# EAGLE design pm25 (EAGLE 9.4.2)
AUTHOR: Jared Wolff; BOARD_NUMBER: BRD-0010; COMPANY: Circuit Dojo; DOC_NUMBER: SCH-0010; DOC_REV: 1; TITLE: Particle^2 Sensor
Assembly variants: Production
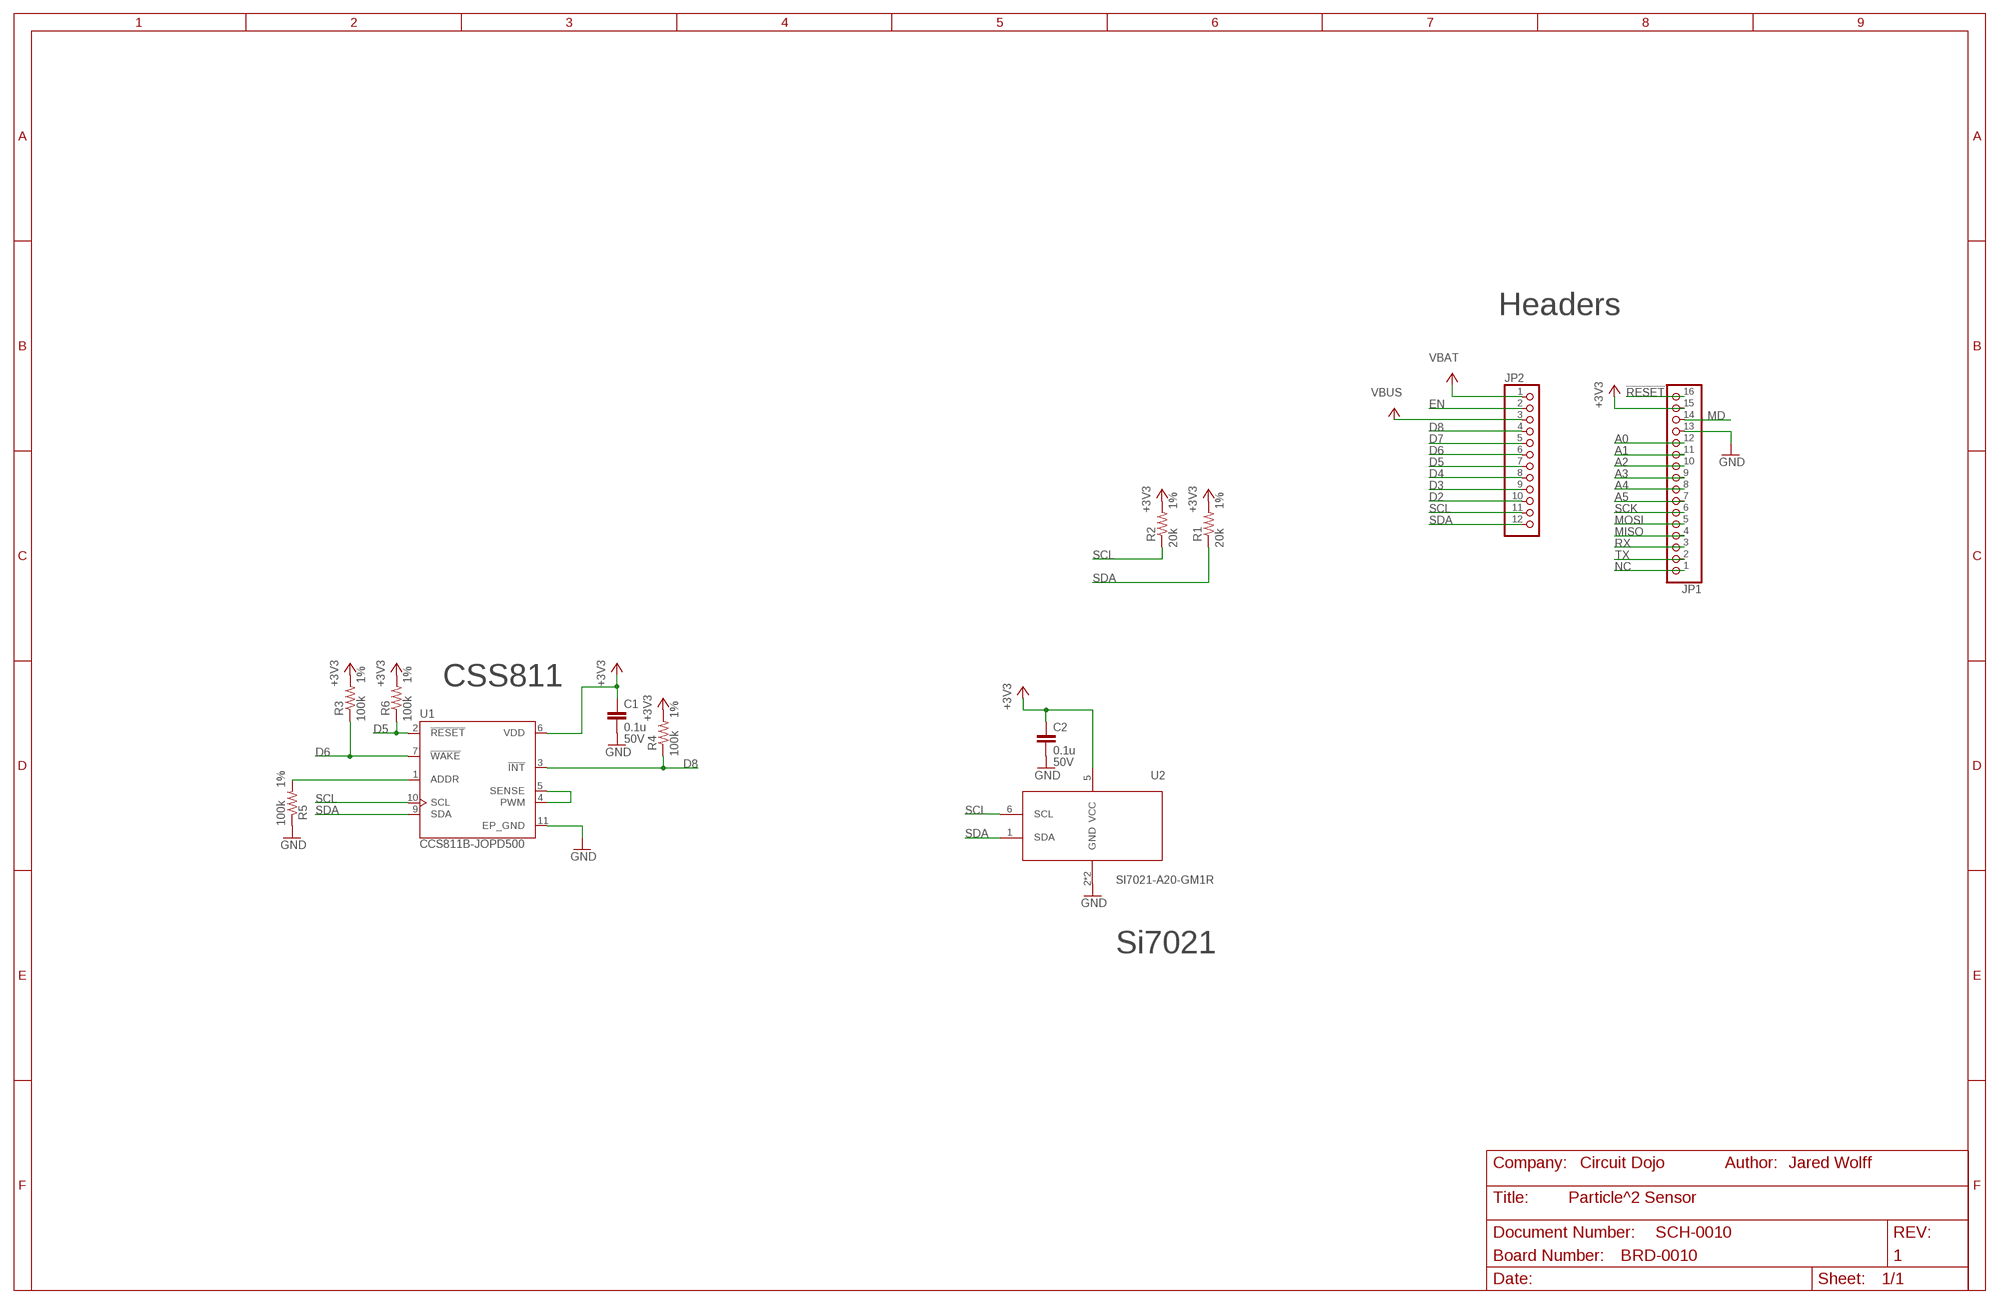
[diagram p0: schematic, sheet 1]

## Parts
C1  0.1u  CAP-0017  [CAPC1005X55N]
C2  0.1u  CAP-0017  [CAPC1005X55N]
JP1  HEADER-1X16ROUND  [1X16_ROUND]
JP2  HEADER-1X12  [1X12_ROUND]
R1  20k  RES-0054  [R0402]
R2  20k  RES-0054  [R0402]
R3  100k  RES-0041  [R0402]
R4  100k  RES-0041  [R0402]
R5  100k  RES-0041  [R0402]
R6  100k  RES-0041  [R0402]
U1  CCS811B-JOPD500  [SON60P400X270X110-11N]
U2  SI7021-A20-GM1R  [SON100P300X300X80-7N]

## Nets
!RESET: JP1.16
+3V3: C1.1 C2.1 JP1.15 R1.2 R2.2 R3.2 R4.2 R6.2 U1.6(VDD) U2.5(VCC)
A0: JP1.12
A1: JP1.11
A2: JP1.10
A3: JP1.9
A4: JP1.8
A5: JP1.7
D2: JP2.10
D3: JP2.9
D4: JP2.8
D5: JP2.7 R6.1 U1.2(!RESET)
D6: JP2.6 R3.1 U1.7(!WAKE)
D7: JP2.5
D8: JP2.4 R4.1 U1.3(!INT)
EN: JP2.2
GND: C1.2 C2.2 JP1.13 R5.1 U1.11(EP_GND) U2.2(GND) U2.7(GND)
MD: JP1.14
MISO: JP1.4
MOSI: JP1.5
N$4: R5.2 U1.1(ADDR)
N$5: U1.4(PWM) U1.5(SENSE)
NC: JP1.1
RX: JP1.3
SCK: JP1.6
SCL: JP2.11 R2.1 U1.10(SCL) U2.6(SCL)
SDA: JP2.12 R1.1 U1.9(SDA) U2.1(SDA)
TX: JP1.2
VBAT: JP2.1
VBUS: JP2.3

## Notes on the sheet
- Headers
- CSS811
- Si7021

## Library data of the parts
C1 C2 = wolff-den:CAP-0017: CAP CER 0.1UF 35V X5R 0402; DESC: CAP CER 0.1UF 50V X5R 0402; DIGIKEYPN: 587-3499-1-ND; MF: Taiyo Yuden; MPN: UMK105BJ104KV-F; VOLTHIGH: 50V
JP1 = microbuilder:HEADER-1X16: PIN HEADER; MPN: PPPC161LFBN-RC
JP2 = microbuilder:HEADER-1X12; MPN: PPPC121LFBN-RC
R1 R2 = wolff-den:RES-0054: RES SMD 20K OHM 1% 1/16W 0402; DIGIKEYPN: 311-20.0KLRCT-ND; MPN: RC0402FR-0720KL; TOLERANCE: 1%; VENDOR: Yageo
R3-R6 = wolff-den:RES-0041: RES SMD 100K OHM 1% 1/16W 0402; DIGIKEYPN: 311-100KLRCT-ND; MPN: RC0402FR07100KL; TOLERANCE: 1%; VENDOR: Yageo
U1 = wolff-den:CCS811B-JOPD500: Low Power Digital Sensor For Ind; DESC: Low Power Digital Sensor For Ind; DIGIKEYPN: CCS811B-JOPD500CT-ND; MF: ams; MPN: CCS811B-JOPD500
U2 = wolff-den:SI7021-A20-GM1R; DESC: SENS HUMID/TEMP 3.6V I2C 2% 6DFN; DIGIKEYPN: 336-4380-1-ND; MPN: SI7021-A20-GM1R

## Board
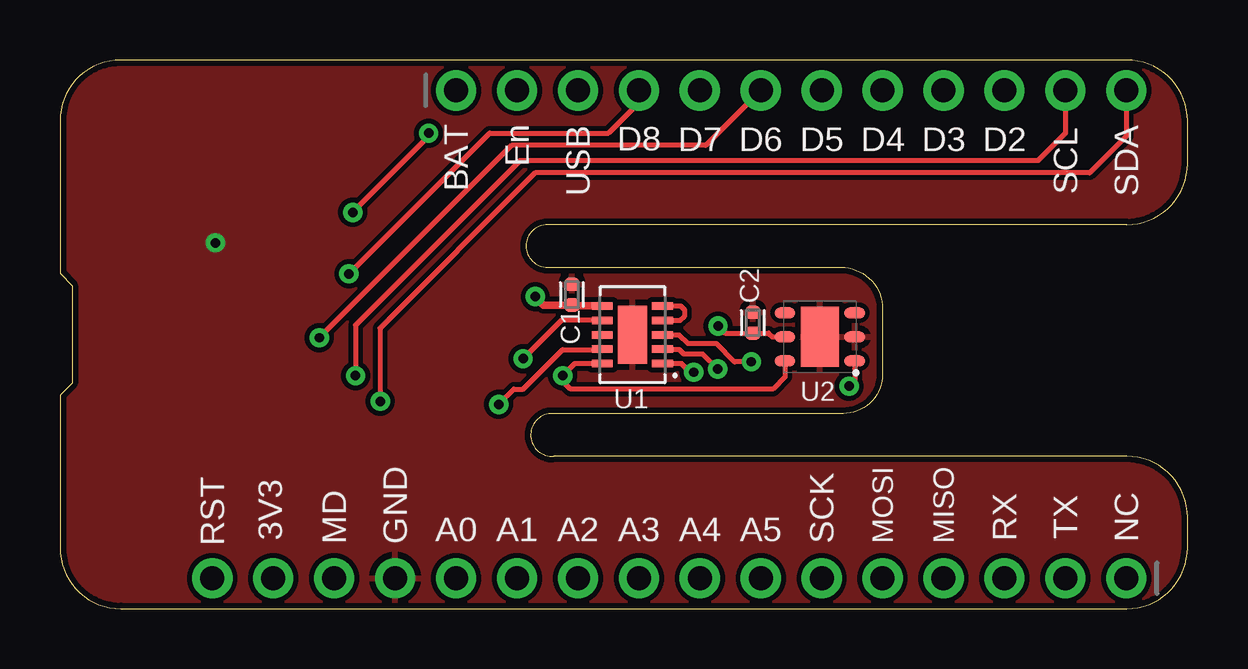
[diagram p1: board, top side]
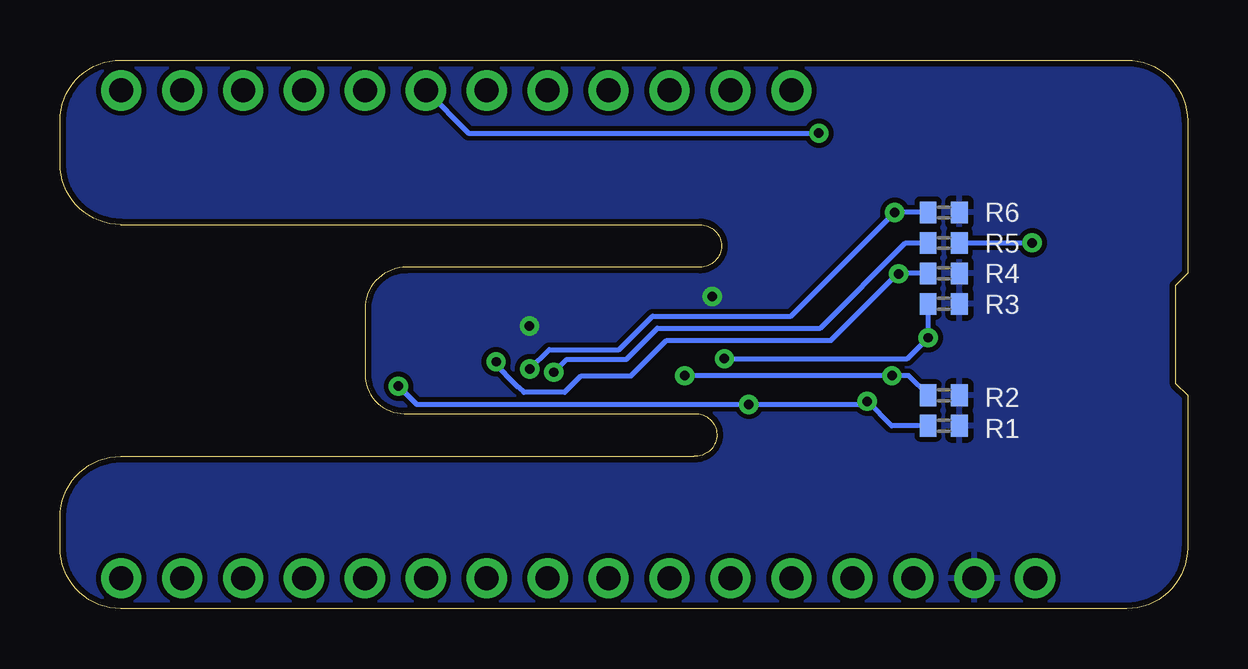
[diagram p2: board, bottom side, seen from below]

Size 47 x 22.86 mm. Coordinates in mm from the lower left corner, seen from the top.
Outline: 47,20.32 47,18.54 arc-90 44.46,16 20.32,16 arc180 20.32,14.22 32.56,14.22 arc-90 34.29,12.49 34.29,9.77 arc-90 32.65,8.13 20.45,8.13 arc180 20.57,6.35 44.46,6.35 arc-90 47,3.81 47,2.54 arc-90 44.46,0 2.54,0 arc-90 0,2.54 0,8.89 0.51,9.4 0.51,13.46 0,13.97 0,20.32 arc-90 2.54,22.86 44.46,22.86
Outline: 47,20.32 arc90 44.46,22.86
Outline: 47,20.32 arc90 44.46,22.86
Outline: 47,20.32 arc90 44.46,22.86
Copper layers (1*16): Top 0.035mm / dielectric 1.5mm / Bottom 0.035mm
Design rules "adafruit *": minimum track width 8mil, minimum drill 15.5mil, track to track 8mil, track to pad 8mil, pad to pad 8mil, via to via 8mil, smd to smd 8mil, copper to edge 10mil, drill to drill 8mil, minimum pad ring 10mil, minimum via ring 8mil, stop-mask expansion 2mil, vias tented up to drill 20mil, thermal gap 10mil

### Footprints (pad centres in the part's own frame; a part is rotated, then mirrored left to right if it is on the bottom)
CAPC1005X55N = smd 0.54 x 0.6: 1 -0.43,0; 2 0.43,0
1X16_ROUND = drill 1 pad 1.676: 1 -19.05,0; 2 -16.51,0; 3 -13.97,0; 4 -11.43,0; 5 -8.89,0; 6 -6.35,0; 7 -3.81,0; 8 -1.27,0; 9 1.27,0; 10 3.81,0; 11 6.35,0; 12 8.89,0; 13 11.43,0; 14 13.97,0; 15 16.51,0; 16 19.05,0
1X12_ROUND = drill 1 pad 1.676: 1 -13.97,0; 2 -11.43,0; 3 -8.89,0; 4 -6.35,0; 5 -3.81,0; 6 -1.27,0; 7 1.27,0; 8 3.81,0; 9 6.35,0; 10 8.89,0; 11 11.43,0; 12 13.97,0
R0402 = smd 0.7 x 0.9: 1 -0.65,0; 2 0.65,0
SON60P400X270X110-11N = smd 0.91 x 0.32: 1 -1.255,1.2; 2 -1.255,0.6; 3 -1.255,0; 4 -1.255,-0.6; 5 -1.255,-1.2; 6 1.255,-1.2; 7 1.255,-0.6; 8 1.255,0; 9 1.255,0.6; 10 1.255,1.2 | smd 1.2 x 2.4: 11 0,0
SON100P300X300X80-7N = smd 0.85 x 0.45: 1 -1.45,1; 2 -1.45,0; 3 -1.45,-1; 4 1.45,-1; 5 1.45,0; 6 1.45,1 | smd 1.6 x 2.5: 7 0,0

### Placement (x,y rotation side)
C1  21.34,13.08 90 top
C2  28.88,11.91 90 top
JP1  25.4,1.27 180 top
JP2  30.48,21.59 0 top
R1  10.16,7.62 0 bottom
R2  10.16,8.89 0 bottom
R3  10.16,12.7 0 bottom
R4  10.16,13.97 0 bottom
R5  10.16,15.24 180 bottom
R6  10.16,16.51 0 bottom
U1  23.86,11.41 180 top
U2  31.68,11.32 180 top

### Tracks (layer width: path | path; a pad name or v marks a point on that pad's centre or on a via)
+3V3  (via drill 0.39)
  Top 0.203: v27.43,11.78 27.73,11.48 C2.1 29.54,11.48 29.7,11.33 U2.5 | C1.1 21.38,12.61
  Top 0.305: U1.6 21.38,12.61 C1.1 20.16,12.65 v19.81,13
  pour Bottom: -2.16,-6.22 -2.16,26.42 51.69,26.42 51.69,-6.22
D5  (via drill 0.39)
  Top 0.203: U1.2 25.81,10.8 26,10.62 26.79,10.62 v27.42,9.99 | v12.21,16.51 12.21,16.52 15.37,19.69 v15.37,19.81
  Bottom 0.203: v27.42,9.99 26.61,10.79 23.69,10.79 22.29,12.19 16.52,12.19 12.45,16.26 | JP2.7 29.97,19.81 v15.37,19.81 | R6.1 v12.21,16.51 | 12.45,16.26 v12.21,16.51 | v12.21,16.51 12.45,16.26
D6  (via drill 0.39)
  Top 0.203: U1.7 20.9,12.01 v19.3,10.41 | v10.81,11.29 18.83,19.3 26.92,19.3 JP2.6
  Bottom 0.203: v19.3,10.41 11.68,10.41 v10.81,11.29 R3.1
D8  (via drill 0.39)
  Top 0.203: U1.3 25.81,11.41 26.17,11.05 27.36,11.05 28.12,10.29 v28.82,10.29 | JP2.4 24.13,21.08 22.86,19.81 17.91,19.81 v12.04,13.95
  Bottom 0.203: v28.82,10.29 28.96,10.29 27.88,9.21 27.86,9.21 27.66,9.01 25.96,9.01 25.27,9.7 23.2,9.7 21.72,11.18 14.86,11.18 12.06,13.97 | R4.1 12.06,13.97 | 12.06,13.97 v12.04,13.95
GND  (via drill 0.39)
  Bottom 0.203: R5.1 v6.48,15.24
  pour Top: -0.64,-5.08 -0.64,25.78 48.9,25.78 49.02,25.65 49.02,-5.08
N$4  (via drill 0.39)
  Top 0.203: U1.1 25.91,10.21 26.27,9.85 v26.42,9.85
  Bottom 0.203: v26.42,9.85 25.88,10.39 23.39,10.39 22.1,11.68 15.31,11.68 11.75,15.24 R5.2
N$5
  Top 0.203: U1.4 25.85,12.01 26.04,12.19 26.04,12.45 25.87,12.61 U1.5
SCL  (via drill 0.39)
  Top 0.203: U2.6 30.23,9.65 29.72,9.14 21.29,9.14 20.95,9.47 v20.95,9.71 21.46,10.21 U1.10 | JP2.11 41.91,19.81 40.77,18.67 19.18,18.67 12.32,11.81 v12.32,9.71
  Bottom 0.203: R2.1 11.63,9.71 v12.32,9.71 v20.95,9.71
SDA  (via drill 0.39)
  Top 0.203: 33.13,10.01 U2.1 33.13,9.5 v32.89,9.27 | JP2.12 44.45,19.69 42.93,18.16 19.81,18.16 13.34,11.68 13.34,8.65 v13.35,8.64 | U1.9 22.59,10.79 20.95,10.79 19.3,9.14 18.92,9.14 v18.29,8.51
  Bottom 0.203: R1.1 12.33,7.62 v13.35,8.64 13.48,8.51 v18.29,8.51 32.13,8.51 v32.89,9.27

### Text on the board
tPlace: D8 | D7 | D6 | D5 | D4 | D3 | D2 | BAT | En | USB | SCL | SDA | RST | 3V3 | MD | GND | SCK | MOSI | MISO | RX | TX | NC | A0 | A1 | A2 | A3 | A4 | A5